# Altium schematic sheet Power_IN.SchDoc: Power in
size A; DocumentNumber: 01; SheetNumber: 3; SheetTotal: 8
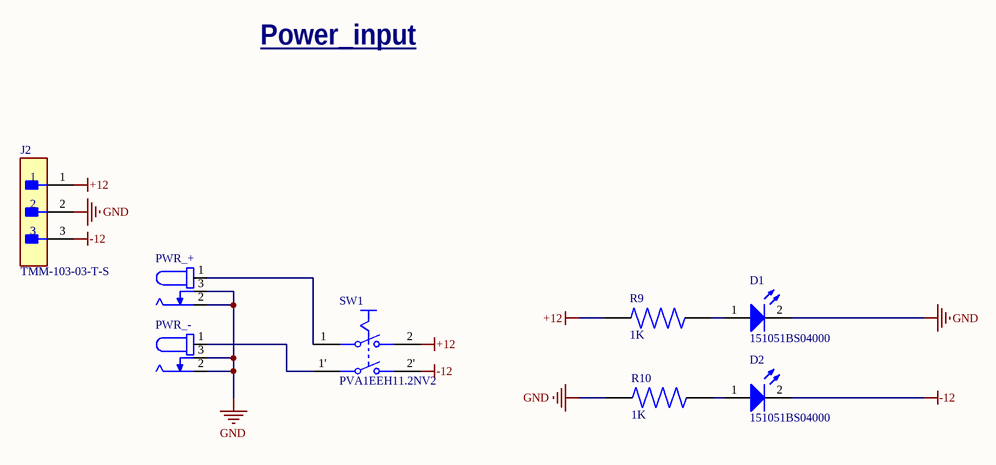
[diagram p0: Power_IN.SchDoc]

## Parts
D1  151051BS04000  [WL-TMRC_D5.9H8.7]
D2  151051BS04000  [WL-TMRC_D5.9H8.7]
J2  TMM-103-03-T-S  [FP-TMM-103-03-T-S-MFG]
PWR_+  Component_2  [694106301002]  (value not drawn)
PWR_-  Component_2  [694106301002]  (value not drawn)
R9  1K  [RESAD1100W55L680D260]
R10  1K  [RESAD1100W55L680D260]
SW1  PVA1EEH11.2NV2  [FP-PVA1EEH11_2NV2-MFG]

## Nets
+12: J2.1 R9.1 SW1.2
-12: D2.2(K) J2.3 SW1.2'
GND: D1.2(K) J2.2 PWR_+.2 PWR_+.3 PWR_-.2 PWR_-.3 R10.1
NetD1_1: D1.1(A) R9.2
NetD2_1: D2.1(A) R10.2
NetPWR_+_1: PWR_+.1 SW1.1
NetPWR_-_1: PWR_-.1 SW1.1'

## Notes on the sheet
- Power_input

## Library data of the parts
D1 D2 = CMP-1488-00009-2: NexarPartId: 29717812; Test Current: 20mA; Forward Voltage: 3.2V; Wavelength: 470nm; Lens Size: 5mm; Lens Style: Circular, Diffused, Round; Forward Current: 100mA; Peak Wavelength: 465nm; Viewing Angle: 40°; Luminous Intensity: 500mcd; Max Reverse Voltage (DC): 5V; Color: Blue; Case/Package: Radial; Width: 5mm; Mount: Through Hole; Min Operating Temperature: -40°C; Length: 5mm; Height: 8.6mm; Max Operating Temperature: 85°C; Packaging: Bulk; RoHS: Compliant; REACH SVHC: Unknown; Dominant Wavelength: 470nm
J2 = CMP-02766-001695-1: CONN HEADER VERT 3POS 2MM; Gender: Male; Number of Positions: 3; Max Current Rating: 3.9A; Max Voltage Rating (AC): 500V; Packaging: Bulk; RoHS Compliant: Yes; Mount: Through Hole; Length: 6mm; Contact Type: Male Pin; Package Quantity: 1; Depth: 1.97mm; Contact Material: Bronze; Insulation Material: Polymer; Series: TMM; Contact Plating: Tin; Fastening Type: Pull; Housing Color: Black; Pitch: 2mm; Termination: Solder; Contact Mating Length: 0.157inch; Min Operating Temperature: -55°C; REACH SVHC: No SVHC; Orientation: Straight; Number of Rows: 1; Color: Black; Insulation Color: Black; Connector Type: Header; Radiation Hardening: No; Number of Contacts: 3; Lead Free: Lead Free; Contact Finish - Mating: TIN; Max Operating Temperature: 105°C; Housing Material: Polymer; Contact Shape: Square
R9 R10 = MFR-25FBF52-1K: 1.07 kOhms Â±1% 0.25W, 1/4W Through Hole Resistor Axial - Metal Film; MF: Yageo; SnapEDA_Link: https://www.snapeda.com/parts/MFR-25FBF52-1K/Yageo/view-part/?ref=snap; Package: RADIAL-2 YAGEO; Value: *; MP: MFR-25FBF52-1K; Check_prices: https://www.snapeda.com/parts/MFR-25FBF52-1K/Yageo/view-part/?ref=eda
SW1 = CMP-10035-000009-1: SWITCH PUSH DPST 0.1A 32V; Switch Function: Off-On; Current Rating: 100mA; Electrical Life: 100000Cycles; RoHS Compliant: Yes; Throw Configuration: DPST; Max Operating Temperature: 85°C; Voltage Rating (DC): 32V; Mount: Through Hole; Series: PVA; Min Operating Temperature: -40°C; Termination: PC Pin; Packaging: Bulk